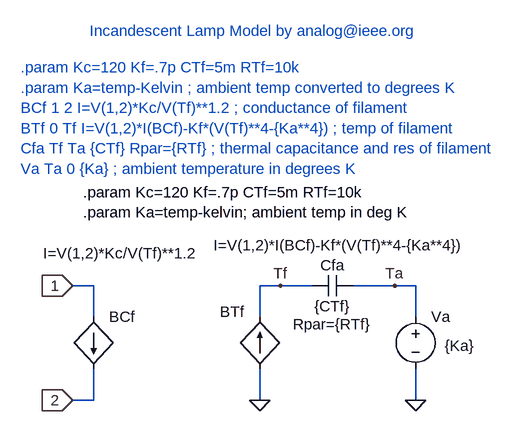
[diagram p0: schematic Lamp.asc]
Lamp.asc, the LTspice schematic file:
Version 4
SHEET 1 880 680
WIRE 0 432 0 384
WIRE 0 304 0 256
WIRE 240 384 240 432
WIRE -256 256 -256 304
WIRE -256 384 -256 432
WIRE -256 432 -288 432
WIRE -288 256 -256 256
WIRE 240 256 240 304
WIRE 80 256 32 256
WIRE 240 256 208 256
WIRE 32 256 0 256
WIRE 208 256 144 256
FLAG 0 432 0
FLAG 240 432 0
FLAG 32 256 Tf
FLAG 208 256 Ta
FLAG -288 256 1
IOPIN -288 256 In
FLAG -288 432 2
IOPIN -288 432 In
SYMBOL bi 0 384 R180
WINDOW 0 24 88 Left 0
WINDOW 3 71 190 Right 0
SYMATTR InstName BTf
SYMATTR Value I=V(1,2)*I(BCf)-Kf*(V(Tf)**4-{Ka**4})
SYMBOL cap 80 272 R270
WINDOW 0 32 32 VTop 0
WINDOW 3 0 32 VBottom 0
WINDOW 39 -28 32 VBottom 0
SYMATTR InstName Cfa
SYMATTR Value {CTf}
SYMATTR SpiceLine Rpar={RTf}
SYMBOL voltage 240 288 R0
WINDOW 3 45 60 Left 0
SYMATTR Value {Ka}
SYMATTR InstName Va
SYMBOL bi -256 304 R0
WINDOW 3 41 -98 Center 0
SYMATTR Value I=V(1,2)*Kc/V(Tf)**1.2
SYMATTR InstName BCf
TEXT -272 112 Left 0 !.param Kc=120 Kf=.7p CTf=5m RTf=10k\n.param Ka=temp-kelvin; ambient temp in deg K
TEXT -368 -80 Left 0 ;.param Kc=120 Kf=.7p CTf=5m RTf=10k\n.param Ka=temp-Kelvin ; ambient temp converted to degrees K\nBCf 1 2 I=V(1,2)*Kc/V(Tf)**1.2 ; conductance of filament\nBTf 0 Tf I=V(1,2)*I(BCf)-Kf*(V(Tf)**4-{Ka**4}) ; temp of filament\nCfa Tf Ta {CTf} Rpar={RTf} ; thermal capacitance and res of filament\nVa Ta 0 {Ka} ; ambient temperature in degrees K
TEXT -8 -136 Center 0 ;Incandescent Lamp Model by analog@ieee.org

The netlist it stands for:
* Lamp.asc
BTf 0 Tf I=V(1,2)*I(BCf)-Kf*(V(Tf)**4-{Ka**4})
Cfa Tf Ta {CTf} Rpar={RTf}
Va Ta 0 {Ka}
BCf 1 2 I=V(1,2)*Kc/V(Tf)**1.2
.param Kc=120 Kf=.7p CTf=5m RTf=10k
.param Ka=temp-kelvin; ambient temp in deg K
* .param Kc=120 Kf=.7p CTf=5m RTf=10k
* .param Ka=temp-Kelvin ; ambient temp converted to degrees K
* BCf 1 2 I=V(1,2)*Kc/V(Tf)**1.2 ; conductance of filament
* BTf 0 Tf I=V(1,2)*I(BCf)-Kf*(V(Tf)**4-{Ka**4}) ; temp of filament
* Cfa Tf Ta {CTf} Rpar={RTf} ; thermal capacitance and res of filament
* Va Ta 0 {Ka} ; ambient temperature in degrees K
* Incandescent Lamp Model by analog@ieee.org
.backanno
.end